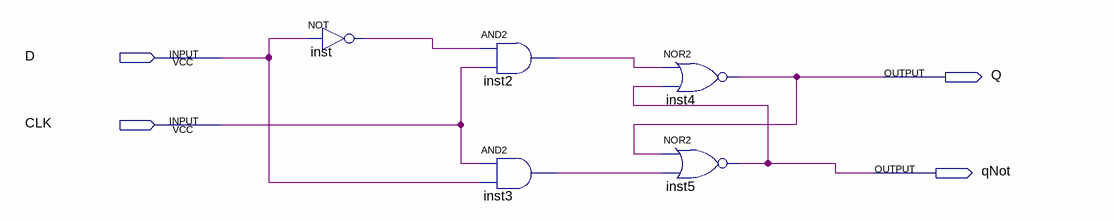
[diagram p0: schematic sheet]
// Quartus schematic NoEdgeDFF.bdf as structural Verilog: 5 symbols, 4 pins
module NoEdgeDFF (
  input  D,
  input  CLK,
  output Q,
  output qNot
);

  wire inst2_out, inst3_out, inst_out;

  not inst (inst_out, D);
  and inst2 (inst2_out, inst_out, CLK);
  and inst3 (inst3_out, CLK, D);
  nor inst4 (Q, inst2_out, qNot);
  nor inst5 (qNot, Q, inst3_out);
endmodule
